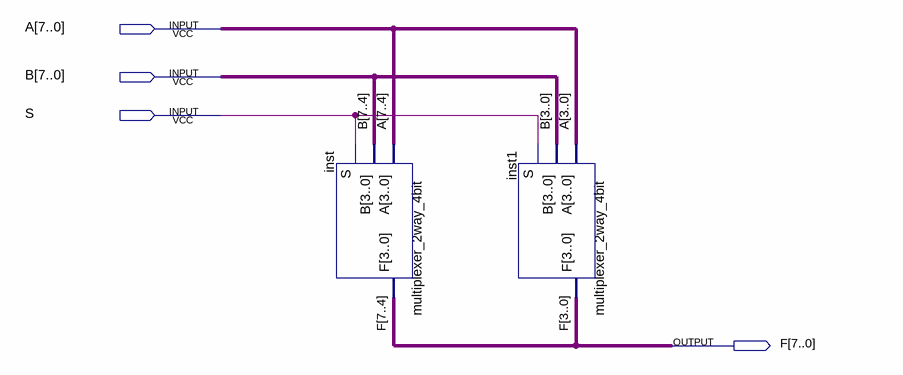
[diagram p0: schematic sheet]
// Quartus schematic multiplexer_2way_8bit.bdf as structural Verilog: 2 symbols, 4 pins
module multiplexer_2way_8bit (
  input  [7:0] A,
  input  [7:0] B,
  input  S,
  output [7:0] F
);

  multiplexer_2way_4bit inst (.A(A[7:4]), .B(B[7:4]), .S(S), .F(F[7:4]));
  multiplexer_2way_4bit inst1 (.A(A[3:0]), .B(B[3:0]), .S(S), .F(F[3:0]));
endmodule
